# Altium schematic sheet Switches, UI.SchDoc
size A; DocumentNumber: 9; SheetNumber: 9; SheetTotal: 16
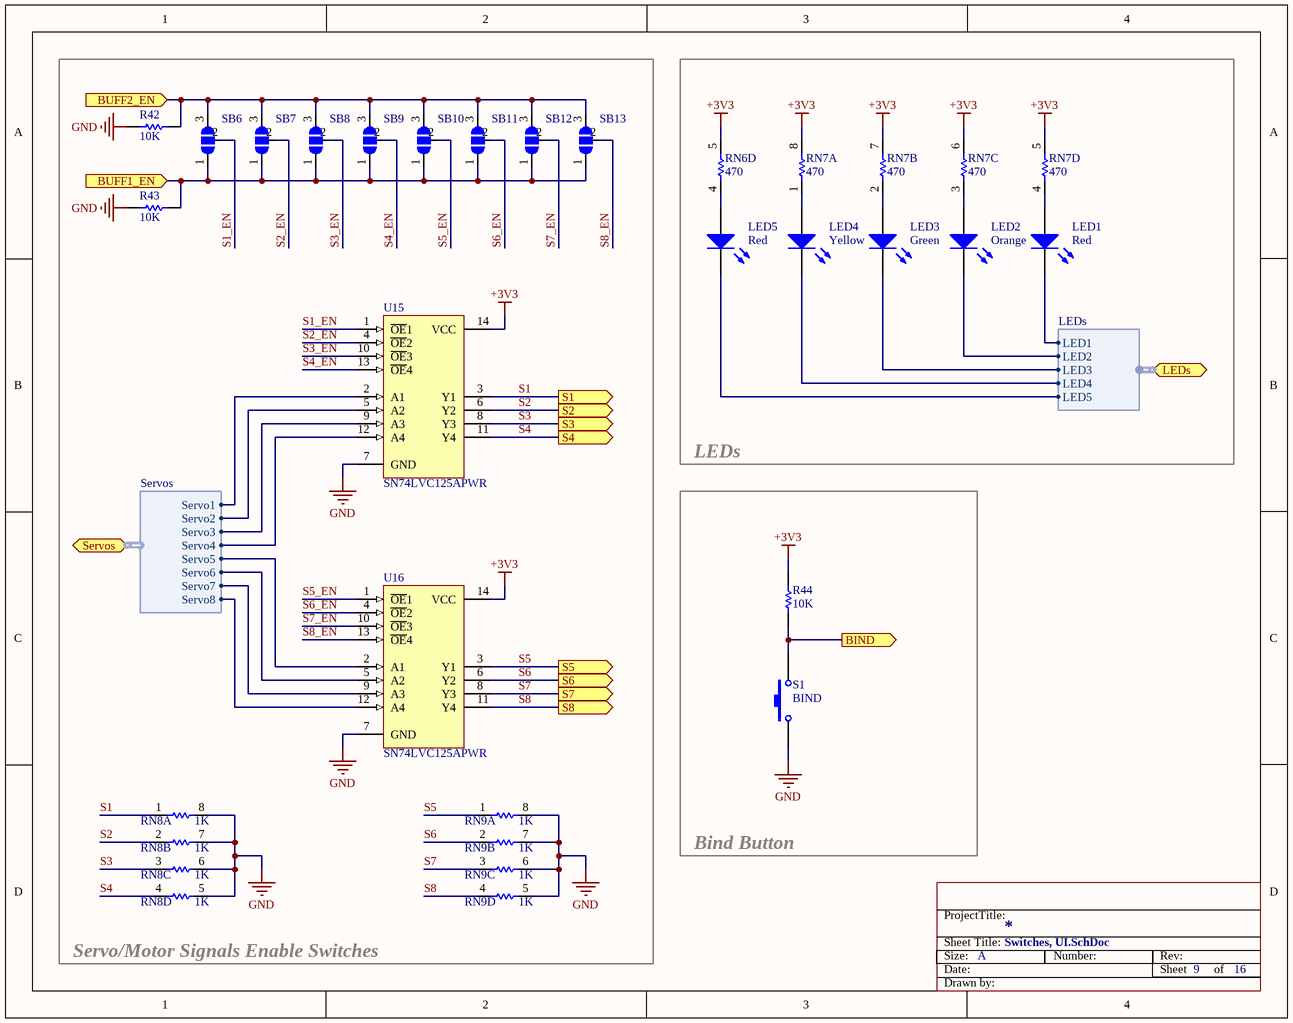
[diagram p0: Switches, UI.SchDoc]

## Parts
LED1  Color: Red  [LED_0603[1608M]]  (hidden comment: LED)
LED2  Color: Orange  [LED_0603[1608M]]  (hidden comment: LED)
LED3  Color: Green  [LED_0603[1608M]]  (hidden comment: LED)
LED4  Color: Yellow  [LED_0603[1608M]]  (hidden comment: LED)
LED5  Color: Red  [LED_0603[1608M]]  (hidden comment: LED)
R42  value 10K  [RES_0402[1005M]]  (hidden comment: RES)
R43  value 10K  [RES_0402[1005M]]  (hidden comment: RES)
R44  value 10K  [RES_0402[1005M]]  (hidden comment: RES)
RN6  value 470  [RES ARRAY SMD]  (hidden comment: Res Network 1)  (part D of 4)
RN7  value 470  [RES ARRAY SMD]  (hidden comment: Res Network 1)  (parts A,B,C,D of 4)
RN8  value 1K  [RES ARRAY SMD]  (hidden comment: Res Network 1)  (parts A,B,C,D of 4)
RN9  value 1K  [RES ARRAY SMD]  (hidden comment: Res Network 1)  (parts A,B,C,D of 4)
S1  BIND  [SMD TACTILE SW KMR 2]
SB6  SMD Jumper 1  [SMD JUMPER 1]  (value not drawn)  (no BOM)
SB7  SMD Jumper 1  [SMD JUMPER 1]  (value not drawn)  (no BOM)
SB8  SMD Jumper 1  [SMD JUMPER 1]  (value not drawn)  (no BOM)
SB9  SMD Jumper 1  [SMD JUMPER 1]  (value not drawn)  (no BOM)
SB10  SMD Jumper 1  [SMD JUMPER 1]  (value not drawn)  (no BOM)
SB11  SMD Jumper 1  [SMD JUMPER 1]  (value not drawn)  (no BOM)
SB12  SMD Jumper 1  [SMD JUMPER 1]  (value not drawn)  (no BOM)
SB13  SMD Jumper 1  [SMD JUMPER 1]  (value not drawn)  (no BOM)
U15  SN74LVC125APWR  [TSSOP-14]
U16  SN74LVC125APWR  [TSSOP-14]

## Blocks framed on the sheet
Servo/Motor Signals Enable Switches: R42 R43 RN8 RN9 SB6-SB13 U15 U16
LEDs: LED1-LED5 RN6 RN7
Bind Button: R44 S1

## Ports
BIND (out), BUFF1_EN (in), BUFF2_EN (in), LEDs (harness LEDs), S1 (out), S2 (out), S3 (out), S4 (out), S5 (out), S6 (out), S7 (out), S8 (out), Servos (harness Servos)

## Harnesses
LEDs: LED1, LED2, LED3, LED4, LED5
Servos: Servo1, Servo2, Servo3, Servo4, Servo5, Servo6, Servo7, Servo8

## Nets
+3V3: R44.2 RN6.5 RN7.5 RN7.6 RN7.7 RN7.8 U15.14(VCC) U16.14(VCC)
GND: R42.2 R43.2 RN8.5 RN8.6 RN8.7 RN8.8 RN9.5 RN9.6 RN9.7 RN9.8 S1.1 U15.7(GND) U16.7(GND)
BIND: R44.1 S1.2 ; port BIND
BUFF1_EN: R43.1 SB6.1 SB7.1 SB8.1 SB9.1 SB10.1 SB11.1 SB12.1 SB13.1 ; port BUFF1_EN
BUFF2_EN: R42.1 SB6.3 SB7.3 SB8.3 SB9.3 SB10.3 SB11.3 SB12.3 SB13.3 ; port BUFF2_EN
S1: RN8.1 U15.3(Y1) ; port S1
S1_EN: SB6.2 U15.1(~{OE}1)
S2: RN8.2 U15.6(Y2) ; port S2
S2_EN: SB7.2 U15.4(~{OE}2)
S3: RN8.3 U15.8(Y3) ; port S3
S3_EN: SB8.2 U15.10(~{OE}3)
S4: RN8.4 U15.11(Y4) ; port S4
S4_EN: SB9.2 U15.13(~{OE}4)
S5: RN9.1 U16.3(Y1) ; port S5
S5_EN: SB10.2 U16.1(~{OE}1)
S6: RN9.2 U16.6(Y2) ; port S6
S6_EN: SB11.2 U16.4(~{OE}2)
S7: RN9.3 U16.8(Y3) ; port S7
S7_EN: SB12.2 U16.10(~{OE}3)
S8: RN9.4 U16.11(Y4) ; port S8
S8_EN: SB13.2 U16.13(~{OE}4)
NetLED1_1: LED1.1(A) RN7.4
NetLED1_2: LED1.2(K) ; port LEDs.LED1
NetLED2_1: LED2.1(A) RN7.3
NetLED2_2: LED2.2(K) ; port LEDs.LED2
NetLED3_1: LED3.1(A) RN7.2
NetLED3_2: LED3.2(K) ; port LEDs.LED3
NetLED4_1: LED4.1(A) RN7.1
NetLED4_2: LED4.2(K) ; port LEDs.LED4
NetLED5_1: LED5.1(A) RN6.4
NetLED5_2: LED5.2(K) ; port LEDs.LED5
NetU15_2: U15.2(A1) ; port Servos.Servo1
NetU15_5: U15.5(A2) ; port Servos.Servo2
NetU15_9: U15.9(A3) ; port Servos.Servo3
NetU15_12: U15.12(A4) ; port Servos.Servo4
NetU16_2: U16.2(A1) ; port Servos.Servo5
NetU16_5: U16.5(A2) ; port Servos.Servo6
NetU16_9: U16.9(A3) ; port Servos.Servo7
NetU16_12: U16.12(A4) ; port Servos.Servo8

## Notes on the sheet
- Sheet Title:
- ProjectTitle:
- Size:
- Date:
- A
- Number:
- Rev:
- Sheet         of
- Drawn by:

## Library data of the parts
LED1 LED5 = LED: LED RED CLEAR 0603 SMD; Manufacturer: Lite-On Inc.; Manufacturer Part Number: LTST-C190KRKT; Supplier 1: Digi-Key; Supplier Part Number 1: 160-1436-1-ND; ComponentLink1URL: http://optoelectronics.liteon.com/upload/download/DS-22-99-0151/S_110_LTST-C190KRKT.pdf; ComponentLink1Description: Datasheet
LED2 = LED: LED ORANGE CLEAR 0603 SMD; Manufacturer: Lite-On Inc.; Manufacturer Part Number: LTST-C190AKT; Supplier 1: Digi-Key; Supplier Part Number 1: 160-1180-1-ND; ComponentLink1URL: http://media.digikey.com/pdf/Data%20Sheets/Lite-On%20PDFs/LTST-C190AKT.pdf; ComponentLink1Description: Datasheet
LED3 = LED: LED GREEN CLEAR 0603 SMD; Manufacturer: Lite-On Inc.; Manufacturer Part Number: LTST-C190KGKT; Supplier 1: Digi-Key; Supplier Part Number 1: 160-1435-1-ND; ComponentLink1URL: http://optoelectronics.liteon.com/upload/download/DS22-2000-074/S_110_LTST-C190KGKT.pdf; ComponentLink1Description: Datasheet
LED4 = LED: LED YELLOW CLEAR 0603 SMD; Manufacturer: Lite-On Inc.; Manufacturer Part Number: LTST-C190YKT; Supplier 1: Digi-Key; Supplier Part Number 1: 160-1184-1-ND; ComponentLink1URL: http://media.digikey.com/pdf/Data%20Sheets/Lite-On%20PDFs/LTST-C190YKT.pdf; ComponentLink1Description: Datasheet
R42-R44 = RES: Resistor; Manufacturer: Yageo; Manufacturer Part Number: RC0402FR-0710KL; Supplier 1: Digi-Key; Supplier Part Number 1: 311-10.0KLRCT-ND; ComponentLink1URL: http://www.yageo.com/NewPortal/yageodocoutput?fileName=/pdf/R-Chip/PYu-RC_Group_51_RoHS_L_3.pdf; ComponentLink1Description: Datasheet
RN6 RN7 = Res Network 1: Isolated Resistor Network; Manufacturer: Yageo; Manufacturer Part Number: YC164-JR-07470RL; Supplier 1: Digi-Key; Supplier Part Number 1: YC164J-470CT-ND; ComponentLink1URL: http://www.yageo.com/NewPortal/yageodocoutput?fileName=/pdf/R-Chip/PYu-YC_TC_group_51_RoHS_L_0.pdf; ComponentLink1Description: Datasheet
RN8 RN9 = Res Network 1: Isolated Resistor Network; Manufacturer Part Number: YC164-JR-071KL; Manufacturer: Yageo; Supplier 1: Digi-Key; Supplier Part Number 1: YC164J-1.0KCT-ND; ComponentLink1URL: http://www.yageo.com/NewPortal/yageodocoutput?fileName=/pdf/R-Chip/PYu-YC_TC_group_51_RoHS_L_0.pdf; ComponentLink1Description: Datasheet
S1 = SW-PB: SWITCH TACTILE SPST-NO 0.05A 32V; pin to pad: 2>4; Manufacturer Part Number: KMR221GLFS; Manufacturer: C&K Components; Supplier 1: Digi-Key; Supplier Part Number 1: 401-1427-1-ND; ComponentLink1URL: http://www.mouser.com/ds/2/60/KMR2_9aug12-25127.pdf; ComponentLink1Description: Datasheet
SB6-SB13 = SMD Jumper 1: SMD Jumper 3 positions. Open
U15 U16 = DM74LS125AM: Manufacturer: Texas Instruments; Current - Output High, Low: 24mA, 24mA; Supplier 1: Digi-Key; Supplier Part Number 1: 296-1222-1-ND; ComponentLink1URL: http://www.ti.com/lit/ds/symlink/sn74lvc125a.pdf; ComponentLink1Description: Datasheet; Manufacturer Part Number: SN74LVC125APWR